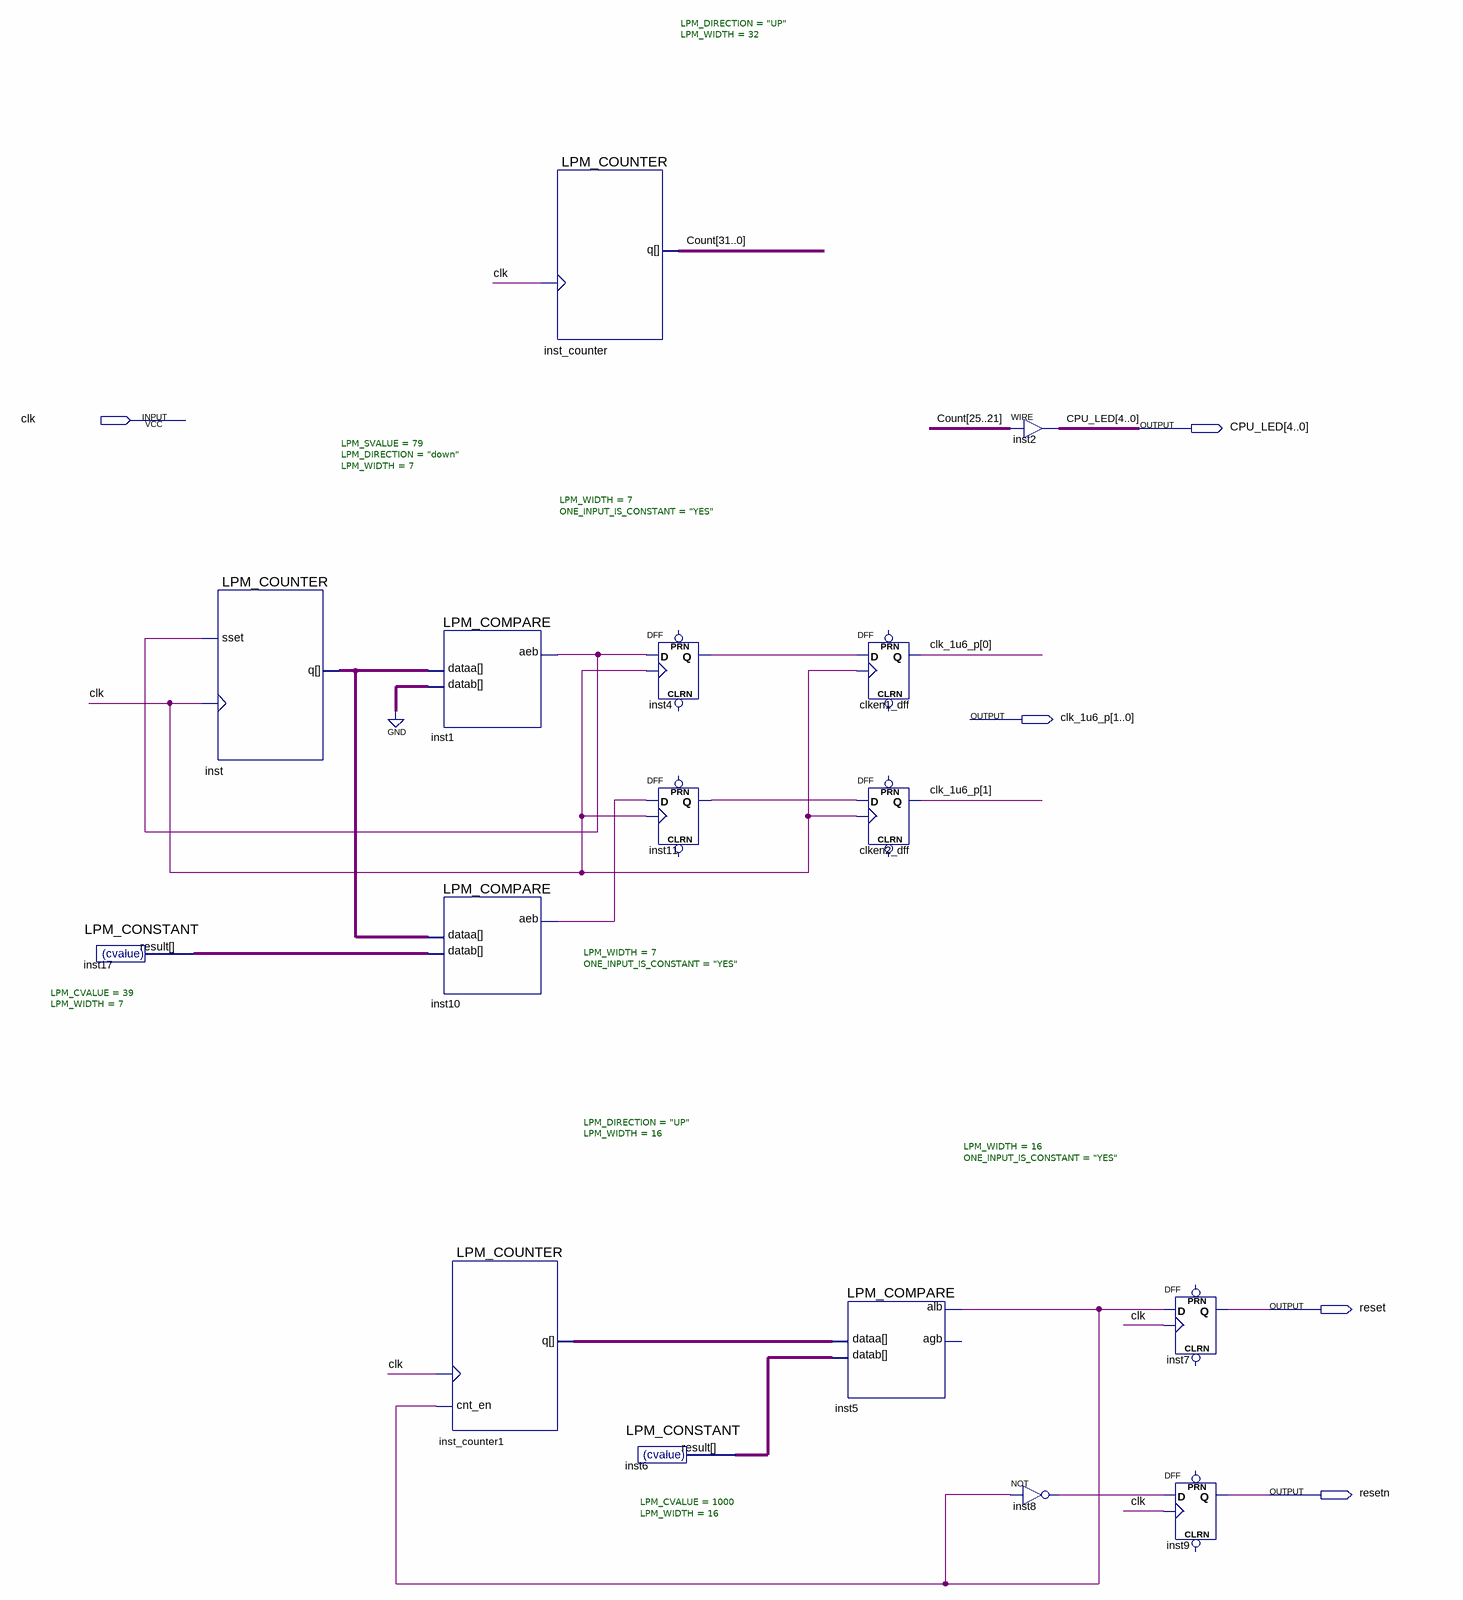
[diagram p0: schematic sheet]
// Quartus schematic CLK_generation.bdf as structural Verilog: 16 symbols, 5 pins
module CLK_generation (
  input  clk,
  output [4:0] CPU_LED,
  output [1:0] clk_1u6_p,
  output reset,
  output resetn
);

  wire inst1_aeb, inst4_q, inst5_alb, inst8_out, inst10_aeb, inst11_q;
  wire [6:0] inst17_result, inst_q;
  wire [15:0] inst6_result, inst_counter1_q;
  wire [31:0] Count;

  LPM_CONSTANT #(.LPM_CVALUE(39), .LPM_WIDTH(7)) inst17 (.result(inst17_result));
  LPM_COUNTER #(.LPM_SVALUE(79), .LPM_DIRECTION("down"), .LPM_WIDTH(7)) inst (
    .clock(clk), .sset(inst1_aeb), .q(inst_q));
  LPM_COMPARE #(.LPM_WIDTH(7), .ONE_INPUT_IS_CONSTANT("YES")) inst1 (
    .dataa(inst_q), .datab({7{1'b0}}), .aeb(inst1_aeb));
  LPM_COMPARE #(.LPM_WIDTH(7), .ONE_INPUT_IS_CONSTANT("YES")) inst10 (
    .dataa(inst_q), .datab(inst17_result), .aeb(inst10_aeb));
  LPM_COUNTER #(.LPM_DIRECTION("UP"), .LPM_WIDTH(16)) inst_counter1 (
    .clock(clk), .cnt_en(inst5_alb), .q(inst_counter1_q));
  LPM_COUNTER #(.LPM_DIRECTION("UP"), .LPM_WIDTH(32)) inst_counter (.clock(clk), .q(Count));
  DFF inst4 (.CLK(clk), .D(inst1_aeb), .Q(inst4_q));  // open: CLRN, PRN
  DFF inst11 (.CLK(clk), .D(inst10_aeb), .Q(inst11_q));  // open: CLRN, PRN
  LPM_CONSTANT #(.LPM_CVALUE(1000), .LPM_WIDTH(16)) inst6 (.result(inst6_result));
  LPM_COMPARE #(.LPM_WIDTH(16), .ONE_INPUT_IS_CONSTANT("YES")) inst5 (
    .dataa(inst_counter1_q), .datab(inst6_result), .alb(inst5_alb));  // open: agb
  DFF clken1_dff (.CLK(clk), .D(inst4_q), .Q(clk_1u6_p[0]));  // open: CLRN, PRN
  DFF clken2_dff (.CLK(clk), .D(inst11_q), .Q(clk_1u6_p[1]));  // open: CLRN, PRN
  assign CPU_LED = Count[25:21];  // WIRE inst2
  not inst8 (inst8_out, inst5_alb);
  DFF inst7 (.CLK(clk), .D(inst5_alb), .Q(reset));  // open: CLRN, PRN
  DFF inst9 (.CLK(clk), .D(inst8_out), .Q(resetn));  // open: CLRN, PRN
endmodule
